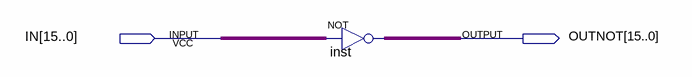
[diagram p0: schematic sheet]
// Quartus schematic NOT16.bdf as structural Verilog: 1 symbols, 2 pins
module NOT16 (
  input  [15:0] IN,
  output [15:0] OUTNOT
);

  assign OUTNOT = ~IN;  // NOT inst, 16 bits wide
endmodule
